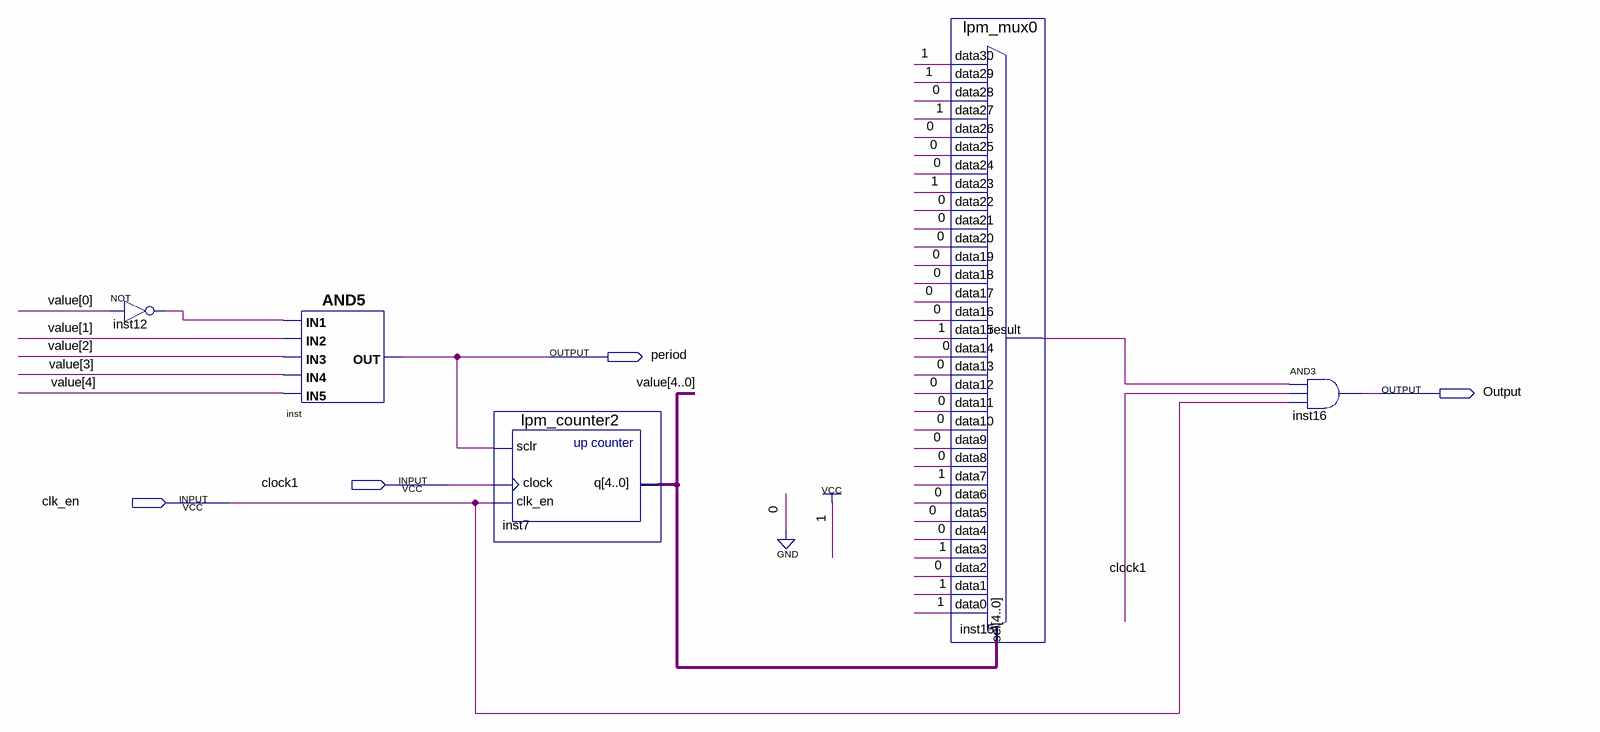
[diagram p0: schematic sheet]
// Quartus schematic MUX.bdf as structural Verilog: 5 symbols, 4 pins
module MUX (
  input  clock1,
  input  clk_en,
  output period,
  output Output
);

  wire inst12_out, inst15_result;
  wire [4:0] value;

  not inst12 (inst12_out, value[0]);
  and inst (period, inst12_out, value[1], value[2], value[3], value[4]);
  lpm_counter2 inst7 (.sclr(period), .clock(clock1), .clk_en(clk_en), .q(value));
  lpm_mux0 inst15 (
    .data30(1'b1), .data29(1'b1), .data28(1'b0), .data27(1'b1), .data26(1'b0), .data25(1'b0), .data24(1'b0),
    .data23(1'b1), .data22(1'b0), .data21(1'b0), .data20(1'b0), .data19(1'b0), .data18(1'b0), .data17(1'b0),
    .data16(1'b0), .data15(1'b1), .data14(1'b0), .data13(1'b0), .data12(1'b0), .data11(1'b0), .data10(1'b0),
    .data9(1'b0), .data8(1'b0), .data7(1'b1), .data6(1'b0), .data5(1'b0), .data4(1'b0), .data3(1'b1),
    .data2(1'b0), .data1(1'b1), .data0(1'b1), .sel(value), .result(inst15_result));
  and inst16 (Output, inst15_result, clock1, clk_en);
endmodule
